# Altium project esp32.PrjPcb
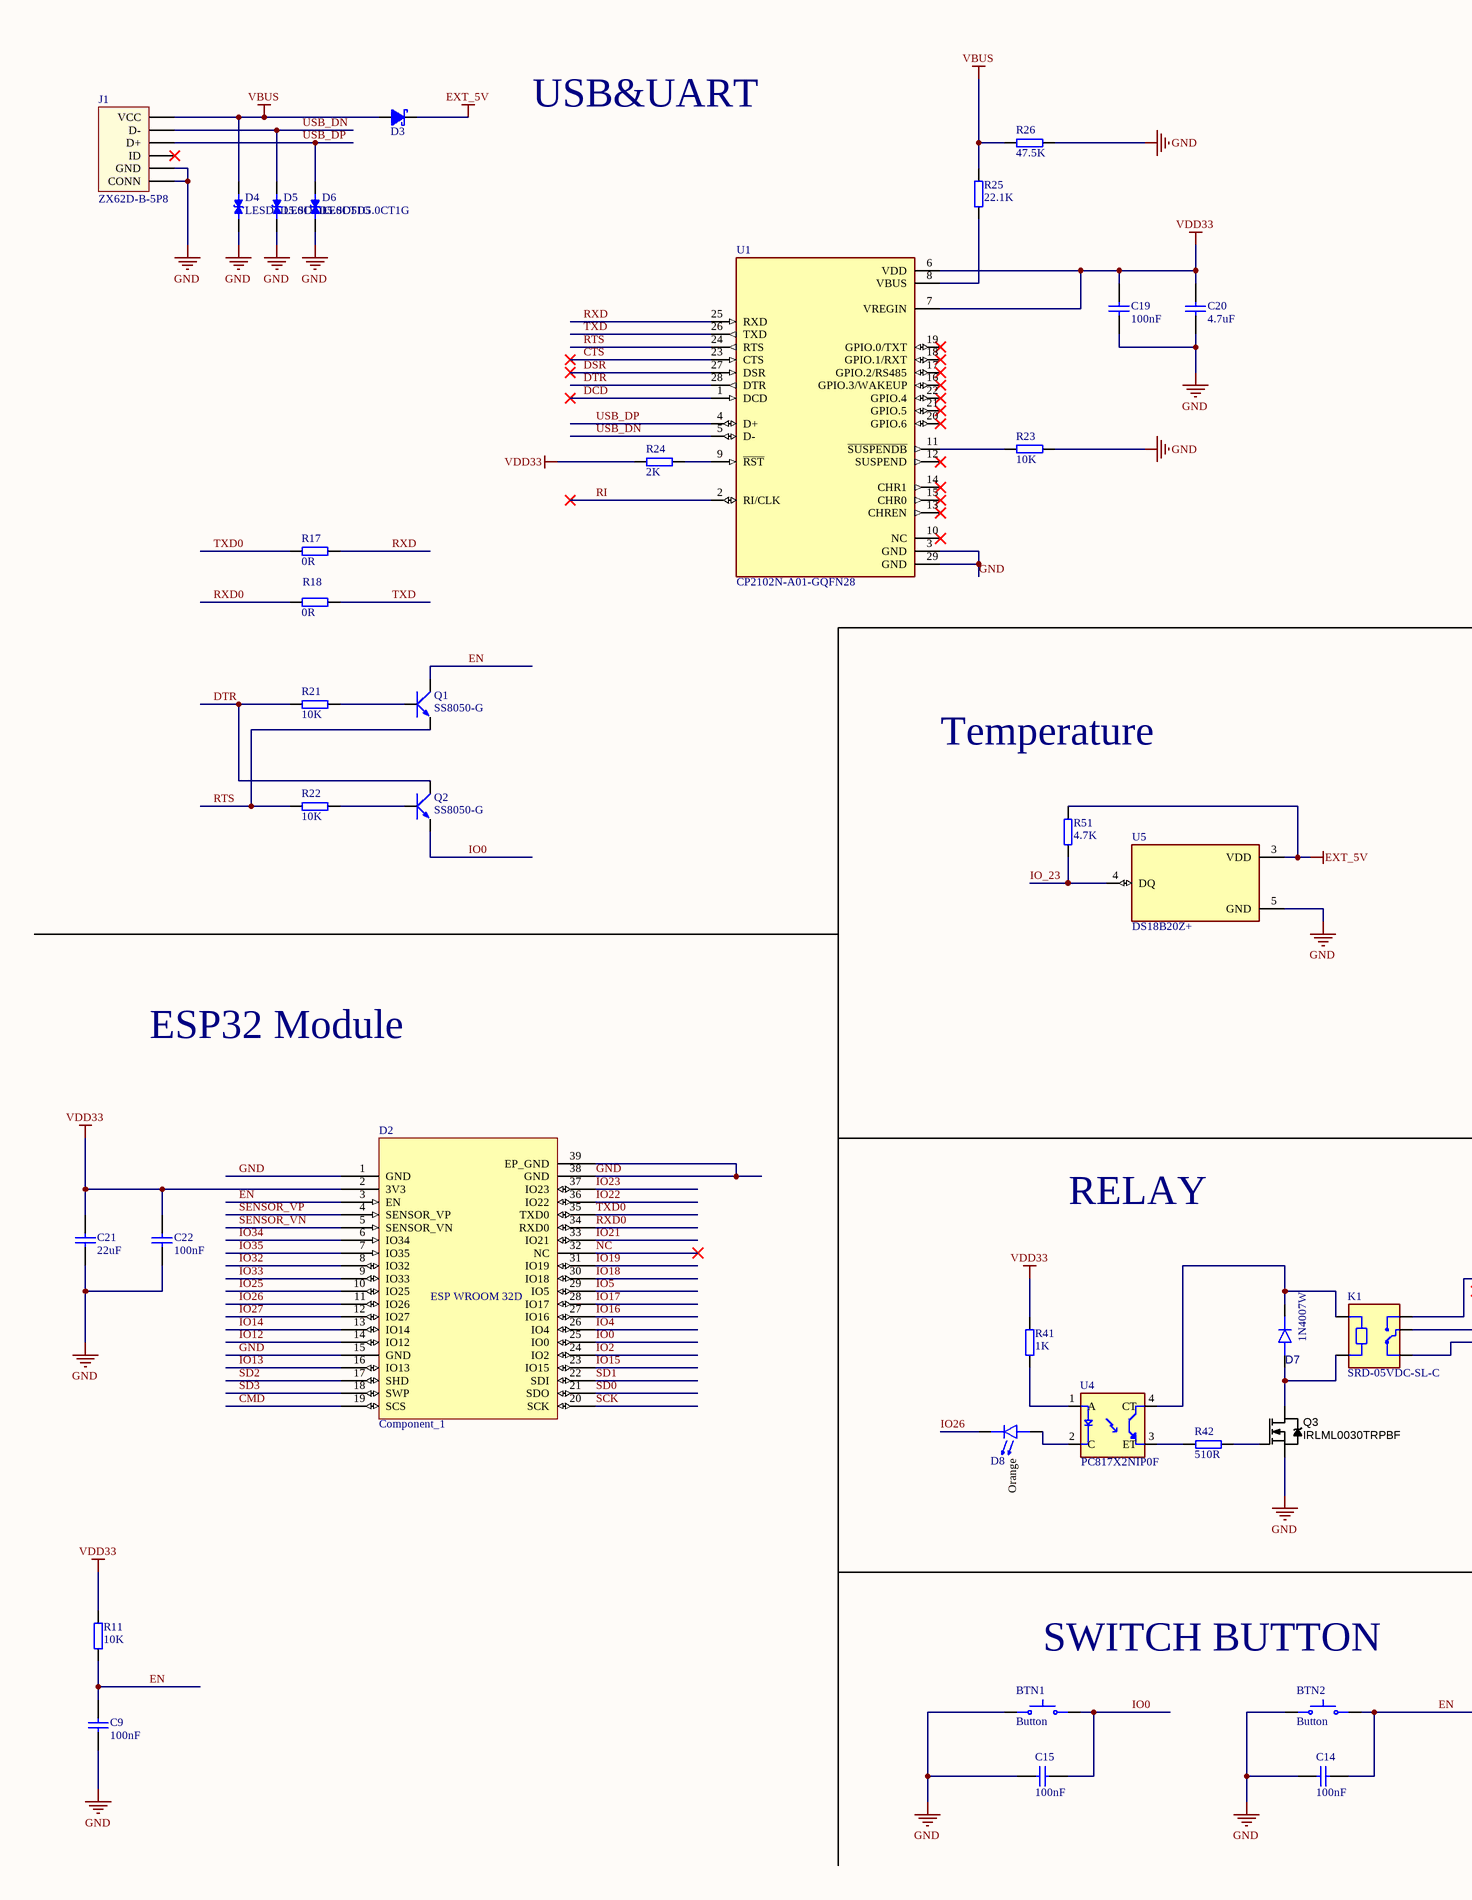
[diagram p0: sheet1.SchDoc, left]
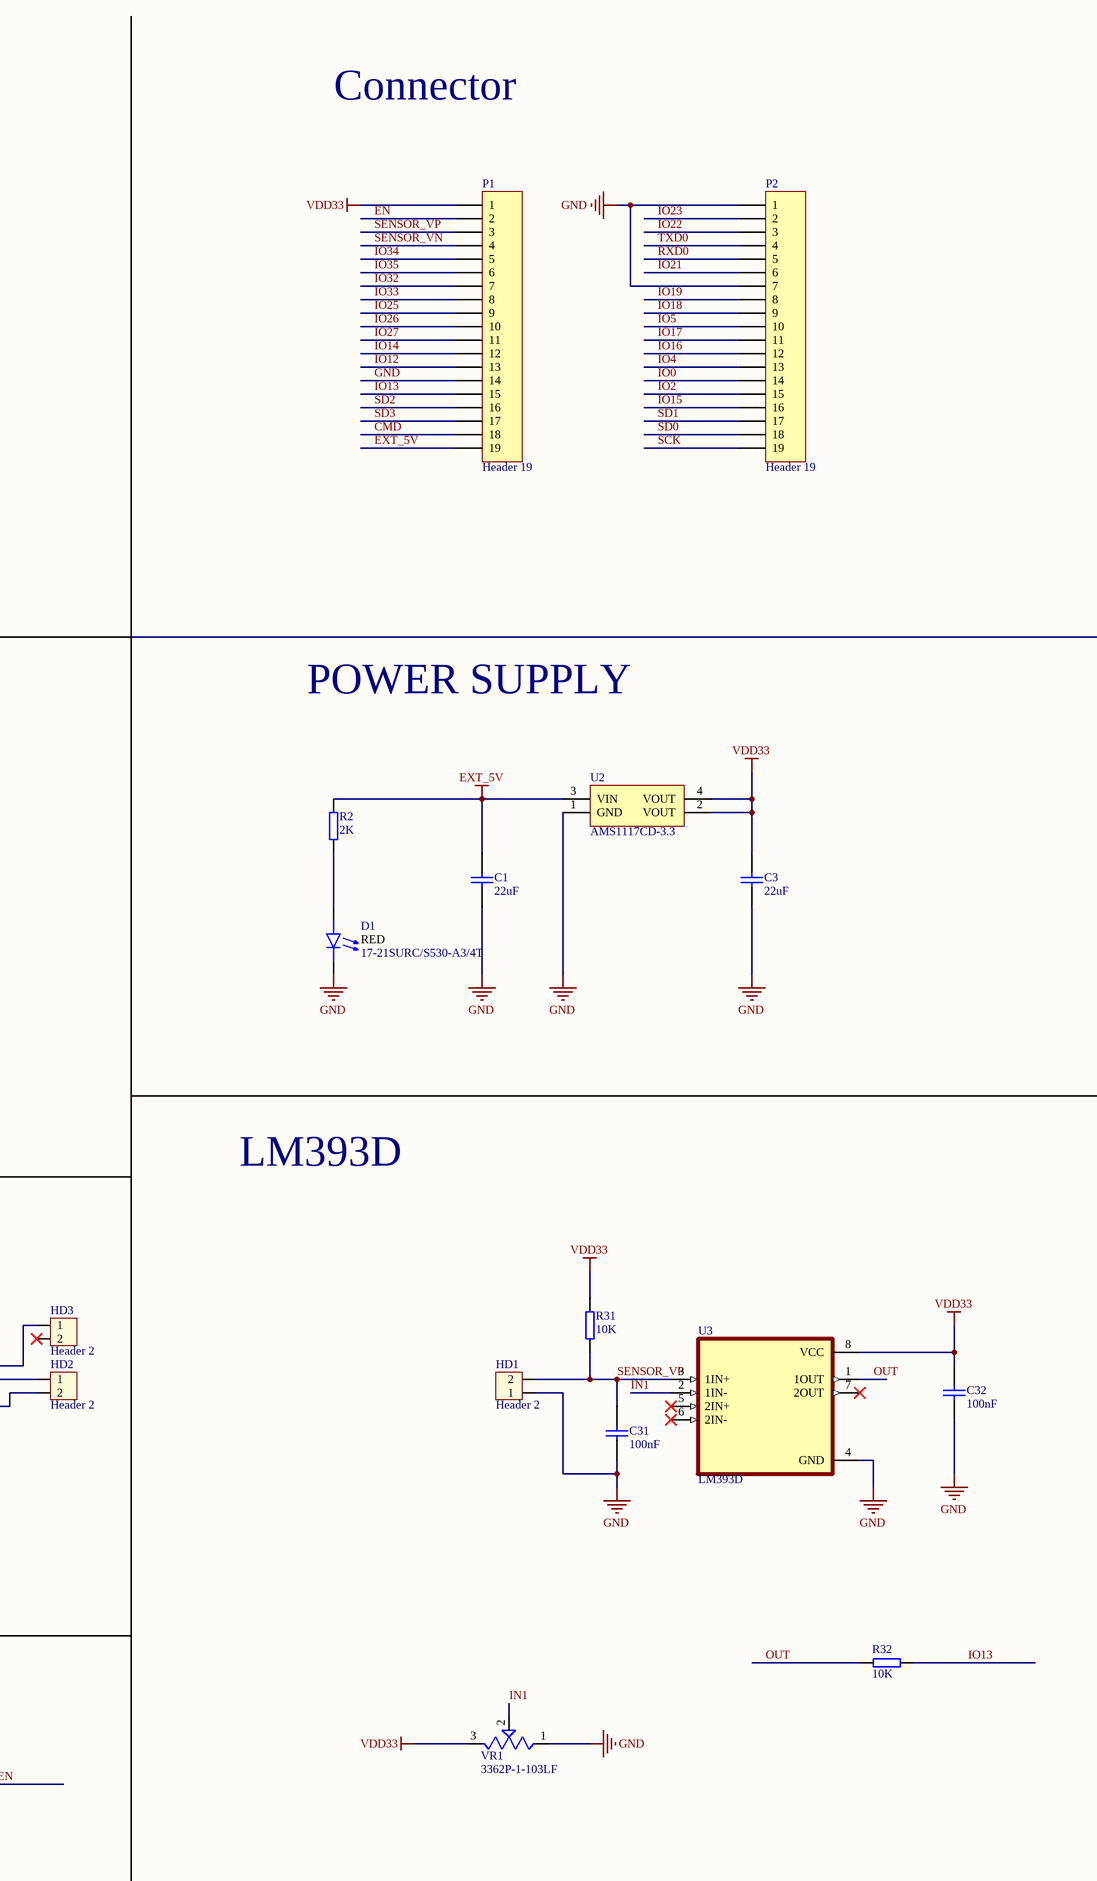
[diagram p1: sheet1.SchDoc, right]
1 sheet, 52 parts. Net scope: global (net labels, ports and power ports of the same name join across sheets).
Board files: PCB1.PcbDoc, PCB2.PcbDoc

## Sheet sheet1.SchDoc
size C; SheetNumber: 1; SheetTotal: 1

### Parts
BTN1  Button  [SW_1571563-7]
BTN2  Button  [SW_1571563-7]
C1  value 22uF  [CAP0603]  (hidden comment: CAP)
C3  value 22uF  [CAP0603]  (hidden comment: CAP)
C9  value 100nF  [CAP0402]  (hidden comment: CAP)
C14  value 100nF  [CAP0402]  (hidden comment: CAP)
C15  value 100nF  [CAP0402]  (hidden comment: CAP)
C19  value 100nF  [CAP0402]  (hidden comment: CAP)
C20  value 4.7uF  [CAP0402]  (hidden comment: CAP)
C21  value 22uF  [CAP0603]  (hidden comment: CAP)
C22  value 100nF  [CAP0402]  (hidden comment: CAP)
C31  value 100nF  [CAP0402]  (hidden comment: CAP)
C32  value 100nF  [CAP0402]  (hidden comment: CAP)
D1  Color: RED  Part Number: 17-21SURC/S530-A3/4T  [0805 (2012 Metric) Orange]  (hidden comment: LED Indication - Discrete)
D2  Component_1  [ESP32-WROOM-32D]
D3  Diode  Schottky 1N5819  [DO-214AC]  (value not drawn)
D4  LESD5D5.0CT1G  [TVS_LESD5D5.0CT1G]
D5  LESD5D5.0CT1G  [TVS_LESD5D5.0CT1G]
D6  LESD5D5.0CT1G  [TVS_LESD5D5.0CT1G]
D7  Part Number: 1N4007W  [DO-204AL, DO-41, Axial]  (hidden comment: Diode)
D8  Color: Orange  [0805 (2012 Metric) Orange]  (hidden comment: LED Indication - Discrete)
HD1  Header 2  [HED2]
HD2  Header 2  [HED2]
HD3  Header 2  [HED2]
J1  ZX62D-B-5P8  [ZX62D-B-5P8]
K1  SRD-05VDC-SL-C  [RELAY_SRD-05VDC-SL-C]
P1  Header 19  [HDR1X19]
P2  Header 19  [HDR1X19]
Q1  SS8050-G  [2N3904 MMBT3904 SOT23]
Q2  SS8050-G  [2N3904 MMBT3904 SOT23]
Q3  IRLML0030TRPBF  [SOT23-3]
R2  value 2K  [RES0402]  (hidden comment: RES)
R11  value 10K  [RES0402]  (hidden comment: RES)
R17  value 0R  [RES0402]  (hidden comment: RES)
R18  value 0R  [RES0402]  (hidden comment: RES)
R21  value 10K  [RES0402]  (hidden comment: RES)
R22  value 10K  [RES0402]  (hidden comment: RES)
R23  value 10K  [RES0402]  (hidden comment: RES)
R24  value 2K  [RES0402]  (hidden comment: RES)
R25  value 22.1K  [RES0402]  (hidden comment: RES)
R26  value 47.5K  [RES0603]  (hidden comment: RES)
R31  value 10K  [RES0402]  (hidden comment: RES)
R32  value 10K  [RES0402]  (hidden comment: RES)
R41  value 1K  [RES0402]  (hidden comment: RES)
R42  value 510R  [RES0402]  (hidden comment: RES)
R51  value 4.7K  [RES0603]  (hidden comment: RES)
U1  CP2102N-A01-GQFN28  [QFN50P500X500X80-29N]
U2  Part Number: AMS1117CD-3.3  [SOT229P700X180-4N]  (hidden comment: AMS1117)
U3  LM393D  [SOIC127P599X175-8N]
U4  PC817X2NIP0F  [SOT254P975X400-4N]
U5  DS18B20Z+  [SOIC127P600X175-8N]
VR1  3362P-1-103LF  [TRIM_3362P-1-103LF]

### Nets
EXT_5V: C1.2 D3.K P1.19 R2.2 R51.2 U2.3(VIN) U5.3(VDD)
GND: BTN1.1 BTN2.1 C1.1 C3.1 C9.1 C14.2 C15.2 C19.1 C20.1 C21.1 C22.1 C31.1 C32.1 D1.1(K) D2.1(GND) D2.15(GND) D2.38(GND) D2.39(EP_GND) D4.1 D5.1 D6.1 HD1.1 J1.0(CONN) J1.5(GND) P1.14 P2.1 P2.7 Q3.2(S) R23.2 R26.2 U1.3(GND) U1.29(GND) U2.1(GND) U3.4(GND) U5.5(GND) VR1.1(CCW)
VBUS: D3.A D4.2 J1.1(VCC) R25.2 R26.1
VDD33: C3.2 C19.2 C20.2 C21.2 C22.2 C32.2 D2.2(3V3) P1.1 R11.2 R24.1 R31.2 R41.2 U1.6(VDD) U1.7(VREGIN) U2.2(VOUT) U2.4(VOUT) U3.8(VCC) VR1.3(CW)
CMD: D2.19(SCS) P1.18
CTS: U1.23(CTS)
DCD: U1.1(DCD)
DSR: U1.27(DSR)
DTR: Q2.3(C) R21.1 U1.28(DTR)
EN: BTN2.2 C9.2 C14.1 D2.3(EN) P1.2 Q1.3(C) R11.1
IN1: U3.2(1IN-) VR1.2(WIPER)
IO0: BTN1.2 C15.1 D2.25(IO0) P2.14 Q2.2(E)
IO2: D2.24(IO2) P2.15
IO4: D2.26(IO4) P2.13
IO5: D2.29(IO5) P2.10
IO12: D2.14(IO12) P1.13
IO13: D2.16(IO13) P1.15 R32.2
IO14: D2.13(IO14) P1.12
IO15: D2.23(IO15) P2.16
IO16: D2.27(IO16) P2.12
IO17: D2.28(IO17) P2.11
IO18: D2.30(IO18) P2.9
IO19: D2.31(IO19) P2.8
IO21: D2.33(IO21) P2.6
IO22: D2.36(IO22) P2.3
IO23: D2.37(IO23) P2.2
IO25: D2.10(IO25) P1.9
IO26: D2.11(IO26) D8.1(K) P1.10
IO27: D2.12(IO27) P1.11
IO32: D2.8(IO32) P1.7
IO33: D2.9(IO33) P1.8
IO34: D2.6(IO34) P1.5
IO35: D2.7(IO35) P1.6
IO_23: R51.1 U5.4(DQ)
NC: D2.32(NC)
OUT: R32.1 U3.1(1OUT)
RI: U1.2(RI/CLK)
RTS: Q1.2(E) R22.1 U1.24(RTS)
RXD: R17.2 U1.25(RXD)
RXD0: D2.34(RXD0) P2.5 R18.1
SCK: D2.20(SCK) P2.19
SD0: D2.21(SDO) P2.18
SD1: D2.22(SDI) P2.17
SD2: D2.17(SHD) P1.16
SD3: D2.18(SWP) P1.17
SENSOR_VN: D2.5(SENSOR_VN) P1.4
SENSOR_VP: C31.2 D2.4(SENSOR_VP) HD1.2 P1.3 R31.1 U3.3(1IN+)
TXD: R18.2 U1.26(TXD)
TXD0: D2.35(TXD0) P2.4 R17.1
USB_DN: D5.2 J1.2(D-) U1.5(D-)
USB_DP: D6.2 J1.3(D+) U1.4(D+)
NetD1_2: D1.2(A) R2.1
NetD7_1: D7.1(K) K1.A1 U4.4(CT)
NetD7_2: D7.2(A) K1.A2 Q3.3(D)
NetD8_2: D8.2(A) U4.2(C)
NetHD2_1: HD2.1 K1.COM
NetHD2_2: HD2.2 K1.NC
NetHD3_1: HD3.1 K1.NO
NetQ1_1: Q1.1(B) R21.2
NetQ2_1: Q2.1(B) R22.2
NetQ3_1: Q3.1(G) R42.2
NetR23_1: R23.1 U1.11(~{SUSPENDB})
NetR24_2: R24.2 U1.9(~{RST})
NetR25_1: R25.1 U1.8(VBUS)
NetR41_1: R41.1 U4.1(A)
NetR42_1: R42.1 U4.3(ET)

Not connected (* = marked no-connect by the designer): HD3 2*; J1 4(ID)*; U1 10(NC)* 12(SUSPEND)* 13(CHREN)* 14(CHR1)* 15(CHR0)* 16(GPIO.3/WAKEUP)* 17(GPIO.2/RS485)* 18(GPIO.1/RXT)* 19(GPIO.0/TXT)* 20(GPIO.6)* 21(GPIO.5)* 22(GPIO.4)*; U3 5(2IN+)* 6(2IN-)* 7(2OUT)*

### Notes on the sheet
- USB&UART
- Connector
- POWER SUPPLY
- Temperature
- ESP32 Module
- LM393D
- RELAY
- SWITCH BUTTON
- (in symbol Component_1) ESP WROOM 32D

### Library data of the parts
BTN1 BTN2 = CMP-011-00020-7: Oreki; Component Type: Switches
C1 C3 C21 = CAP-SM-0603-X5R-10uF: CAP SM 0603 X5R 10uF; Manufacturer: GENERIC; Part Number: CAP-SM-0603-X5R-10uF; Package: 0603
C9 C14 C15 C19 C22 C31 C32 = CAP-SM-0402-X7R-100NF: CAP SM 0402 X7R 100NF; Manufacturer: GENERIC; Part Number: CAP-SM-0402-X7R-100NF; Package: 0402
C20 = CAP-SM-0402-X5R-4.7UF: CAP SM 0402 X5R 4.7UF; Manufacturer: GENERIC; Part Number: CAP-SM-0402-X5R-4.7UF; Package: 0402
D1 = CMP-007-00046-2: Oreki; ComponentLink1Description: DigiKey; JLCPCB Part #: C2943978; Component Type: LED
D3 = Diode  Schottky 1N5819: Diode 1A; Value: 1N4007
D4-D6 = LESD5D5.0CT1G: Transient Voltage Suppressors for ESD Protection; MF: Leshan Radio Co.; Check_prices: https://www.snapeda.com/parts/LESD5D5.0CT1G/Leshan+Radio+Co./view-part/?ref=eda; Value: *; Availability: Not in stock; Package: None; SnapEDA_Link: https://www.snapeda.com/parts/LESD5D5.0CT1G/Leshan+Radio+Co./view-part/?ref=snap; MP: LESD5D5.0CT1G; Price: None
D7 = CMP-004-00033-6: Oreki; Current - Average Rectified (Io): 1A; Capacitance @ Vr, F: 15pF @ 4V, 1MHz; Voltage - DC Reverse (Vr) (Max): 1000 V; Voltage - Forward (Vf) (Max) @ If: .1 V @ 1 A; ComponentLink1Description: DigiKey; JLCPCB Part #: C108803; Component Type: Diodes
D8 = CMP-007-00046-2: Oreki; Part Number: 17-21SURC/S530-A3/4T; ComponentLink1Description: DigiKey; JLCPCB Part #: C2943978; Component Type: LED
HD1 = Header 2: Header 2 (Green); Value: Header 2
HD2 HD3 = Hed2: Header 2 (Green); Value: Header 2
J1 = ZX62D-B-5P8: CONN RCPT MICRO USB R/A SMD; Manufacturer: HIROSE; Part Number: ZX62D-B-5P8; Value: ZX62D-B-5P8
K1 = SRD-05VDC-SL-C: 5V Trigger Relay Module For Arduino And Raspberry Pi 5V Trigger Relay Module For Arduino And Raspberry Pi; MF: Songle Relay; Check_prices: https://www.snapeda.com/parts/SRD-05VDC-SL-C/Songle+Relay/view-part/?ref=eda; Value: *; Availability: Not in stock; Price: None; Package: NON STANDARD-5 Songle Relay; MP: SRD-05VDC-SL-C; SnapEDA_Link: https://www.snapeda.com/parts/SRD-05VDC-SL-C/Songle+Relay/view-part/?ref=snap
P1 P2 = Header 19: Header, 19-Pin; LatestRevisionDate: 17-Jul-2002; LatestRevisionNote: Re-released for DXP Platform.; Publisher: Altium Limited
Q1 Q2 = 2N3904
Q3 = MOSFET_BSS123: MOSFET SMD N-CH 100V 170mA SOT23-3; Manufacturer 1: Diodes Inc; Manufacturer Part Number 1: BSS123-7-F; Ratings: 100V; 170mA; Material: Metal Oxide; SCDType: source; Package / Case: SOT23-3; Supplier 1: Digi-Key; Supplier Part Number 1: BSS123-FDICT-ND
R2 R24 = RES-SM-0402-2K: RES SM 0402 2K; Manufacturer: GENERIC; Part Number: RES-SM-0402-2K; Package: 0402
R11 R21-R23 R31 R32 = RES-SM-0402-10K: RES SM 0402 10K; Manufacturer: GENERIC; Part Number: RES-SM-0402-10K; Package: 0402
R17 R18 = RES-SM-0402-0R: RES SM 0402 0R; Manufacturer: GENERIC; Part Number: RES-SM-0402-0R; Package: 0402
R25 = RES-SM-0402-22K: RES SM 0402 22K; Manufacturer: GENERIC; Part Number: RES-SM-0402-22K; Package: 0402
R26 = RES-SM-0603-33K: RES SM 0603 33K; Manufacturer: GENERIC; Part Number: RES-SM-0603-33K; Package: 0603
R41 = RES-SM-0402-1K: RES SM 0402 1K; Manufacturer: GENERIC; Part Number: RES-SM-0402-1K; Package: 0402
R42 = RES-SM-0402-470R: RES SM 0402 470R; Manufacturer: GENERIC; Part Number: RES-SM-0402-470R; Package: 0402
R51 = RES-SM-0603-4.7K: RES SM 0603 4.7K; Manufacturer: GENERIC; Part Number: RES-SM-0603-4.7K; Package: 0603
U1 = CP2102N-A01-GQFN28: USB Bridge, USB to UART USB 2.0 UART Interface 28-QFN (5x5); MF: Silicon Labs; Price: None; Package: QFN-28 Silicon Labs; Purchase-URL: https://pricing.snapeda.com/search/part/CP2102N-A01-GQFN28/?ref=eda; Availability: In Stock; SnapEDA_Link: https://www.snapeda.com/parts/CP2102N-A01-GQFN28/Silicon+Labs/view-part/?ref=snap; Value: *; MP: CP2102N-A01-GQFN28; Check_prices: https://www.snapeda.com/parts/CP2102N-A01-GQFN28/Silicon+Labs/view-part/?ref=eda
U2 = CMP-019-00049-4: Oreki; ComponentLink2Description: thegioiic; JLCPCB Part #: C347250; ComponentLink1Description: DigiKey; Component Type: Power Supply
U3 = LM393D: Dual differential comparator, commercial grade; MF: Texas Instruments; Check_prices: https://www.snapeda.com/parts/LM393D/Texas+Instruments/view-part/?ref=eda; Value: *; Availability: In Stock; MP: LM393D; Price: None; Package: SOIC-8 Texas Instruments; SnapEDA_Link: https://www.snapeda.com/parts/LM393D/Texas+Instruments/view-part/?ref=snap; Purchase-URL: https://pricing.snapeda.com/search/part/LM393D/?ref=eda
U4 = PC817X2NIP0F: Optoisolator Transistor Output 5000Vrms 1 Channel 4-SMD; MF: Sharp Microelectronics; SnapEDA_Link: https://www.snapeda.com/parts/PC817X2NIP0F/Sharp+Microelectronics/view-part/?ref=snap; Price: None; Check_prices: https://www.snapeda.com/parts/PC817X2NIP0F/Sharp+Microelectronics/view-part/?ref=eda; Purchase-URL: https://pricing.snapeda.com/search/part/PC817X2NIP0F/?ref=eda; MP: PC817X2NIP0F; Value: *; Availability: In Stock; Package: SMD-4 Sharp
U5 = DS18B20Z+: Programmable Resolution 1-Wire Digital Thermometer; MF: Analog Devices; Purchase-URL: https://pricing.snapeda.com/search/part/DS18B20Z+/?ref=eda; Package: SOIC-8 Maxim; Value: *; MP: DS18B20Z+; Check_prices: https://www.snapeda.com/parts/DS18B20Z+/Analog+Devices/view-part/?ref=eda; Price: None; SnapEDA_Link: https://www.snapeda.com/parts/DS18B20Z+/Analog+Devices/view-part/?ref=snap; Availability: In Stock
VR1 = 3362P-1-103LF: Trimmer, Cermet, Rest 10 Kilohms, PCB, 1 Turns, Pwr-Rtg 0.5 W, Tol 10% | Bourns 3362P-1-103LF; SnapEDA_Link: https://www.snapeda.com/parts/3362P-1-103LF/Bourns/view-part/?ref=snap; Package: 3362P-1 Bourns Inc.; Value: *; MF: Bourns; MP: 3362P-1-103LF; Check_prices: https://www.snapeda.com/parts/3362P-1-103LF/Bourns/view-part/?ref=eda